# Altium project Pedal_Filters.PrjPcb
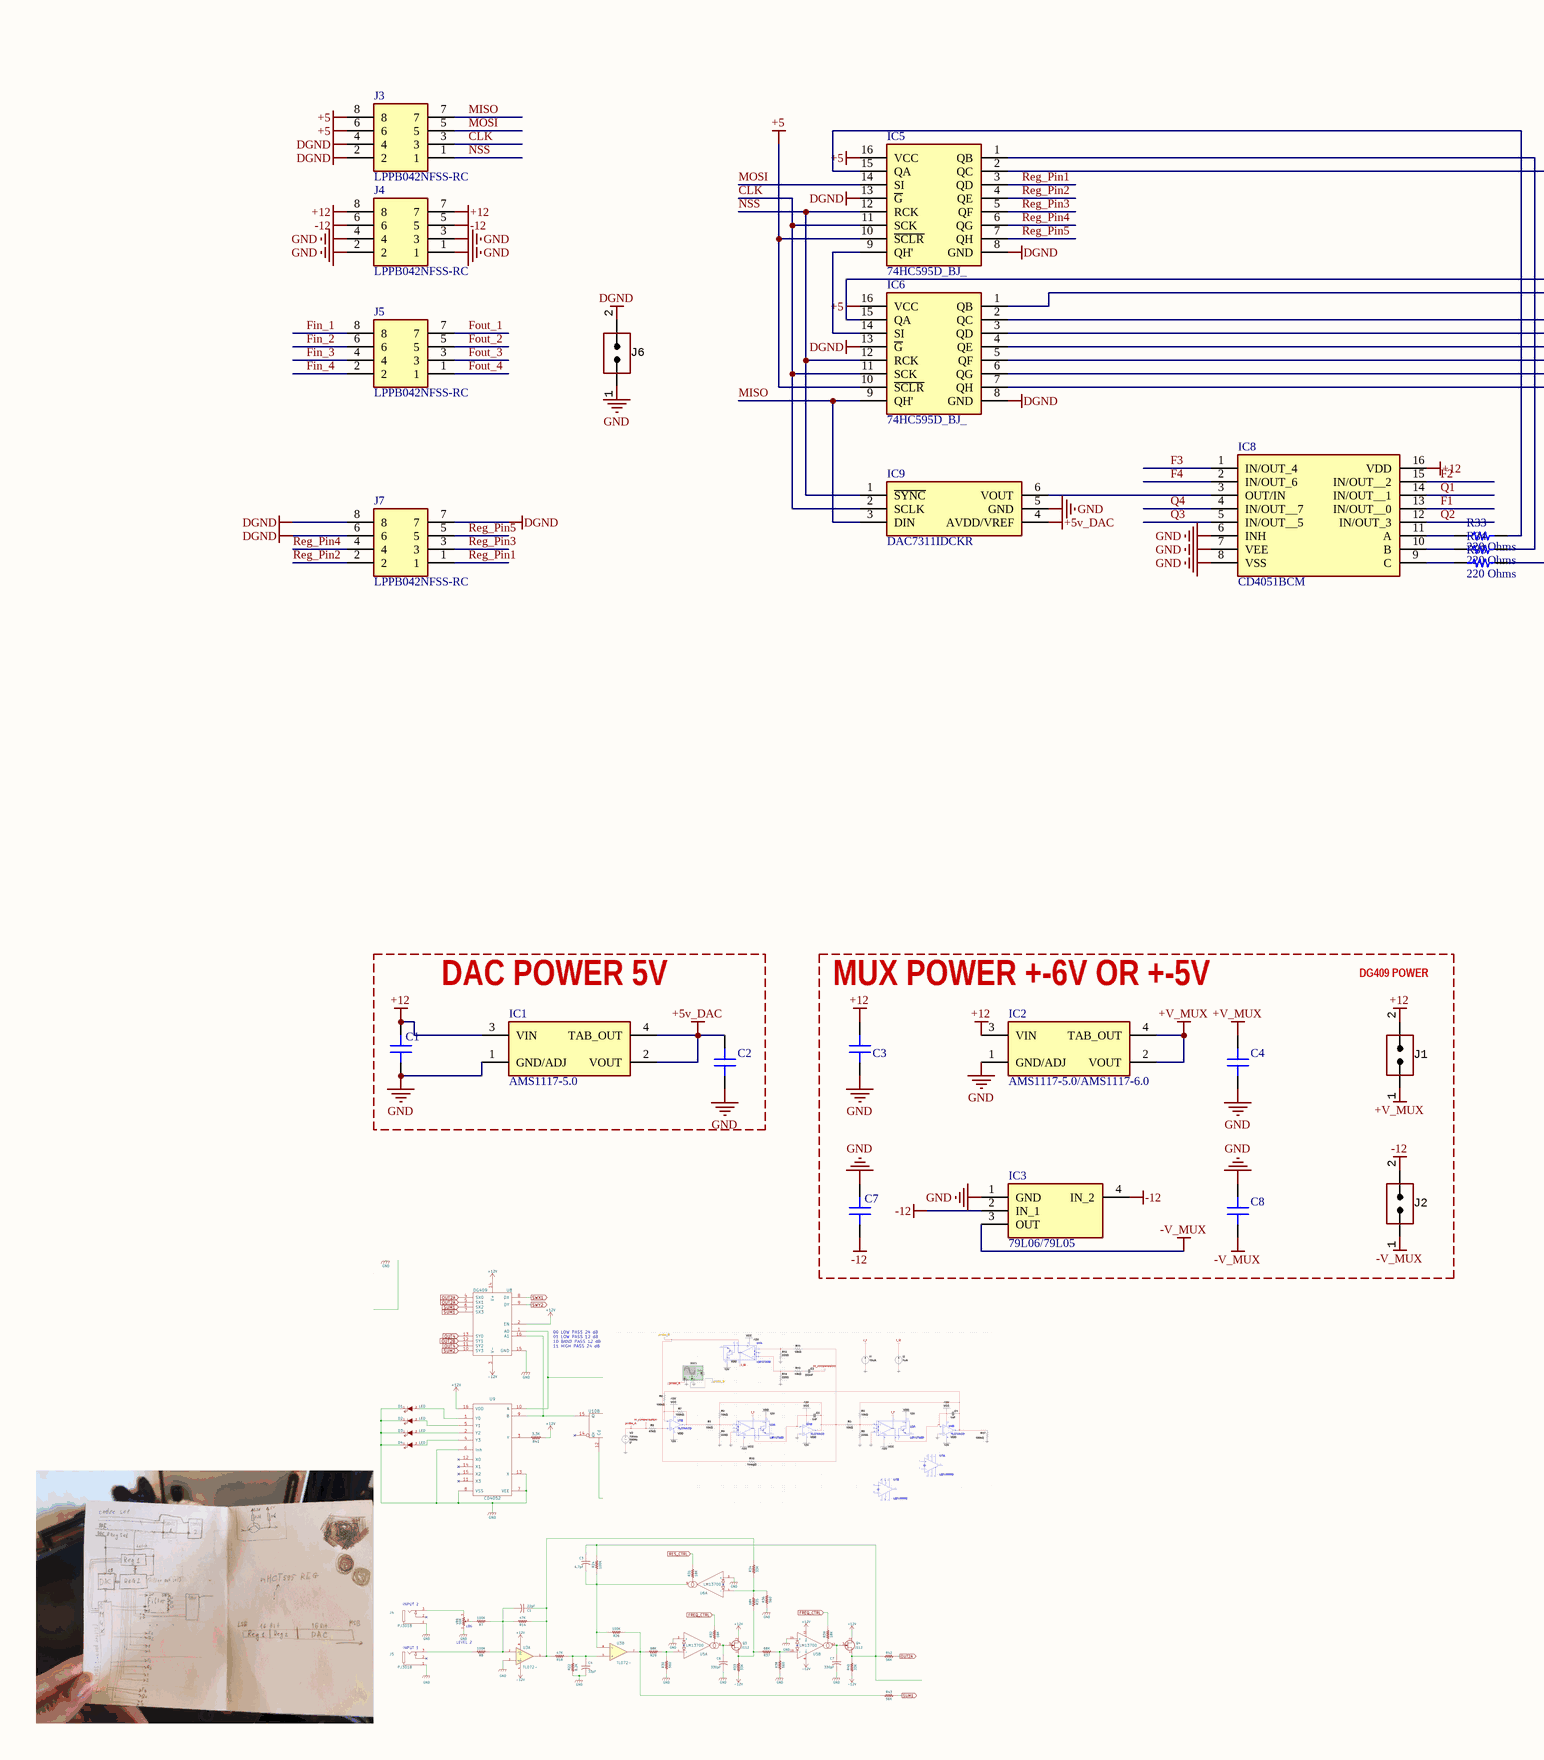
[diagram p0: Pedal_Filters.SchDoc, left]
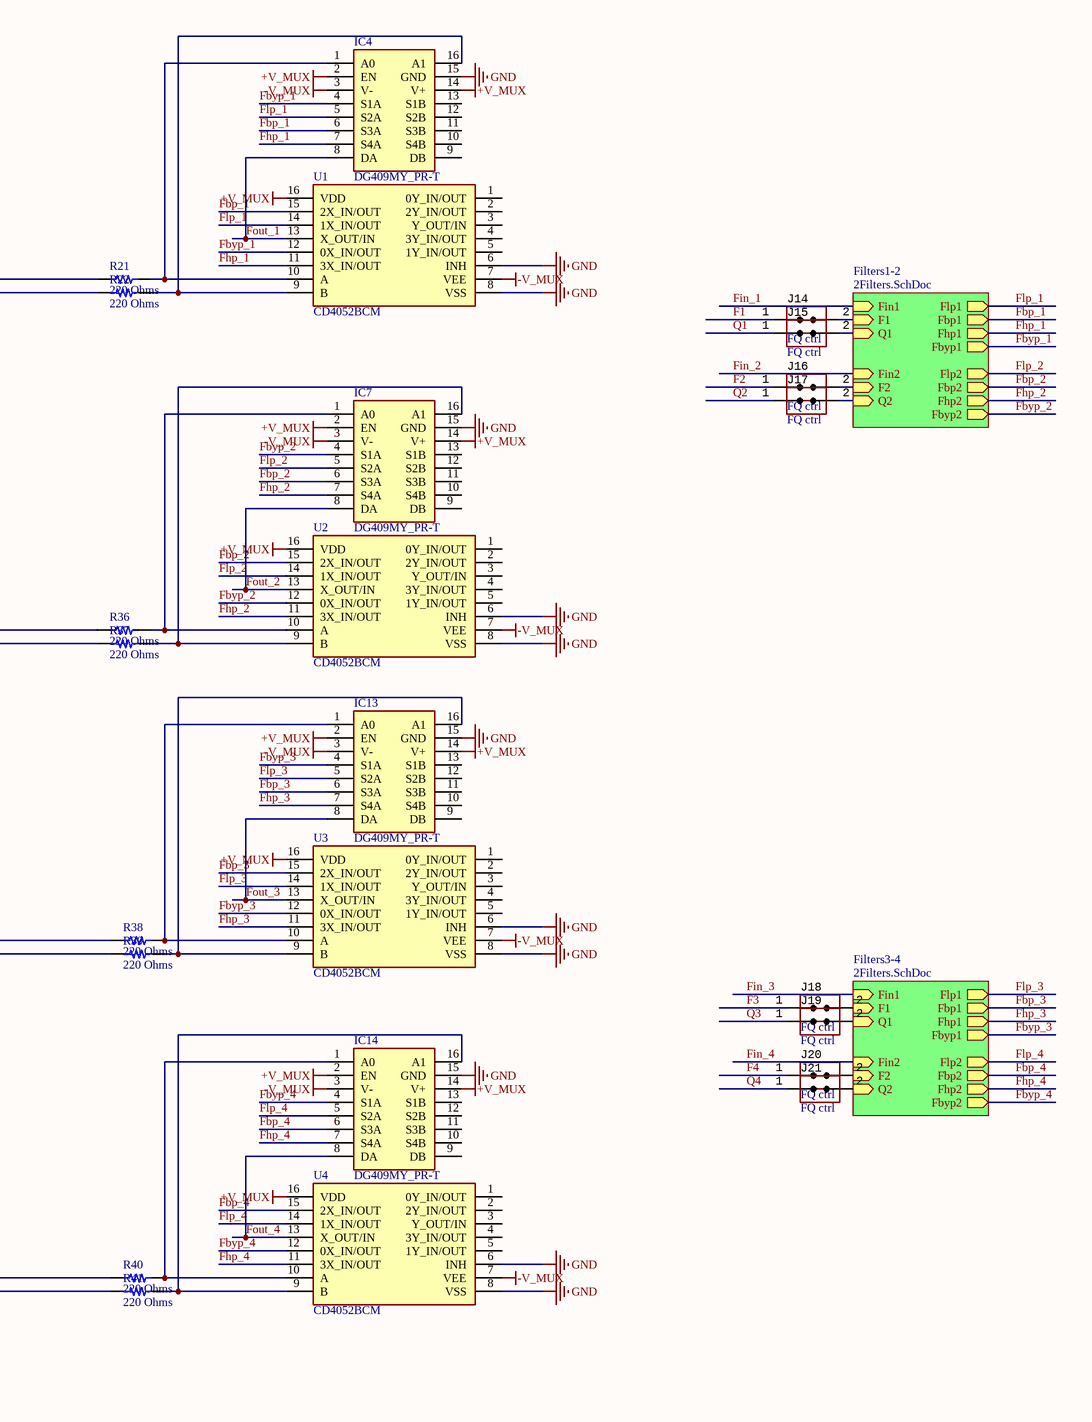
[diagram p1: Pedal_Filters.SchDoc, right]
2 sheets, 245 parts. Net scope: hierarchical (ports join the sheet entries above them; power ports are global).
Board file: Pedal_Filters.PcbDoc
Sheets:
  Pedal_Filters.SchDoc
    Filters1-2 = 2Filters.SchDoc
    Filters3-4 = 2Filters.SchDoc

## Sheet Pedal_Filters.SchDoc
size A2; SheetNumber: 1; SheetTotal: 2

### Parts
C1  (no value)  [CAP 0805_2012]
C2  (no value)  [CAP 0805_2012]
C3  (no value)  [CAP 0805_2012]
C4  (no value)  [CAP 0805_2012]
C7  (no value)  [CAP 0805_2012]
C8  (no value)  [CAP 0805_2012]
IC1  AMS1117-5.0  [SOT-223]
IC2  AMS1117-5.0/AMS1117-6.0  [SOT-223]
IC3  79L06/79L05  [79L06]
IC4  DG409MY_PR-T  [SOIC127P600X175-16N]
IC5  74HC595D_BJ_  [SOIC127P600X175-16N]
IC6  74HC595D_BJ_  [SOIC127P600X175-16N]
IC7  DG409MY_PR-T  [SOIC127P600X175-16N]
IC8  CD4051BCM  [SOIC127P599X175-16N]
IC9  DAC7311IDCKR  [SOT65P210X110-6N]
IC13  DG409MY_PR-T  [SOIC127P600X175-16N]
IC14  DG409MY_PR-T  [SOIC127P600X175-16N]
J1  V_MUX = 12V  [CON: JUMPER x1]  (value not drawn)
J2  V_MUX = 12V  [CON: JUMPER x1]  (value not drawn)
J3  LPPB042NFSS-RC  [LPPB042NFSSRC]
J4  LPPB042NFSS-RC  [LPPB042NFSSRC]
J5  LPPB042NFSS-RC  [LPPB042NFSSRC]
J6  (no value)  [CON: JUMPER x1]
J7  LPPB042NFSS-RC  [LPPB042NFSSRC]
J14  FQ ctrl  [CON: JUMPER x1]
J15  FQ ctrl  [CON: JUMPER x1]
J16  FQ ctrl  [CON: JUMPER x1]
J17  FQ ctrl  [CON: JUMPER x1]
J18  FQ ctrl  [CON: JUMPER x1]
J19  FQ ctrl  [CON: JUMPER x1]
J20  FQ ctrl  [CON: JUMPER x1]
J21  FQ ctrl  [CON: JUMPER x1]
R21  220 Ohms  [RES 0603_1608]
R22  220 Ohms  [RES 0603_1608]
R33  220 Ohms  [RES 0603_1608]
R34  220 Ohms  [RES 0603_1608]
R35  220 Ohms  [RES 0603_1608]
R36  220 Ohms  [RES 0603_1608]
R37  220 Ohms  [RES 0603_1608]
R38  220 Ohms  [RES 0603_1608]
R39  220 Ohms  [RES 0603_1608]
R40  220 Ohms  [RES 0603_1608]
R41  220 Ohms  [RES 0603_1608]
U1  CD4052BCM  [SOIC127P599X175-16N]
U2  CD4052BCM  [SOIC127P599X175-16N]
U3  CD4052BCM  [SOIC127P599X175-16N]
U4  CD4052BCM  [SOIC127P599X175-16N]

### Blocks framed on the sheet
DAC POWER 5V: C1 C2 IC1
MUX POWER +-6V OR +-5V: C3 C4 C7 C8 IC2 IC3 J1 J2

### Sub-sheets
Filters1-2 = 2Filters.SchDoc: Flp1 (out), Fbp1 (out), Fhp1 (out), Fbyp1 (out), Flp2 (out), Fbp2 (out), Fhp2 (out), Fbyp2 (out), Fin2 (in), Fin1 (in), F1 (in), Q1 (in), F2 (in), Q2 (in)
Filters3-4 = 2Filters.SchDoc: Flp1 (out), Fbp1 (out), Fhp1 (out), Fbyp1 (out), Flp2 (out), Fbp2 (out), Fhp2 (out), Fbyp2 (out), F1 (in), Q1 (in), Fin1 (in), Fin2 (in), F2 (in), Q2 (in)

### Nets
+5: IC5.10(~{SCLR}) IC5.16(VCC) IC6.10(~{SCLR}) IC6.16(VCC) J3.6 J3.8
+5v_DAC: C2.2 IC1.2(VOUT) IC1.4(TAB_OUT) IC9.4(AVDD/VREF)
+12: C1.2 C3.1 IC1.3(VIN) IC2.3(VIN) IC8.16(VDD) J1.2(IN) J4.7 J4.8
+V_MUX: C4.2 IC2.2(VOUT) IC2.4(TAB_OUT) IC4.2(EN) IC4.14(V+) IC7.2(EN) IC7.14(V+) IC13.2(EN) IC13.14(V+) IC14.2(EN) IC14.14(V+) J1.1(IN) U1.16(VDD) U2.16(VDD) U3.16(VDD) U4.16(VDD)
-12: C7.1 IC3.2(IN_1) IC3.4(IN_2) J2.2(IN) J4.5 J4.6
-V_MUX: C8.1 IC3.3(OUT) IC4.3(V-) IC7.3(V-) IC13.3(V-) IC14.3(V-) J2.1(IN) U1.7(VEE) U2.7(VEE) U3.7(VEE) U4.7(VEE)
DGND: IC5.8(GND) IC5.13(~{G}) IC6.8(GND) IC6.13(~{G}) J3.2 J3.4 J6.2(IN) J7.6 J7.7 J7.8
GND: C1.1 C2.1 C3.2 C4.1 C7.2 C8.2 IC1.1(GND/ADJ) IC2.1(GND/ADJ) IC3.1(GND) IC4.15(GND) IC7.15(GND) IC8.6(INH) IC8.7(VEE) IC8.8(VSS) IC9.5(GND) IC13.15(GND) IC14.15(GND) J4.1 J4.2 J4.3 J4.4 J6.1(IN) U1.6(INH) U1.8(VSS) U2.6(INH) U2.8(VSS) U3.6(INH) U3.8(VSS) U4.6(INH) U4.8(VSS)
CLK: IC5.11(SCK) IC6.11(SCK) IC9.2(SCLK) J3.3
F1: IC8.13(IN/OUT__0) J14.1(IN)
F2: IC8.15(IN/OUT__2) J16.1(IN)
F3: IC8.1(IN/OUT_4) J18.1(IN)
F4: IC8.2(IN/OUT_6) J20.1(IN)
F_POT_W1: J14.2(IN) ; sheet Filters1-2/F1
F_POT_W1: J18.2(IN) ; sheet Filters3-4/F1  [a separate net that carries the same name]
F_POT_W2: J16.2(IN) ; sheet Filters1-2/F2
F_POT_W2: J20.2(IN) ; sheet Filters3-4/F2  [a separate net that carries the same name]
Fbp_1: IC4.6(S3A) U1.15(2X_IN/OUT) ; sheet Filters1-2/Fbp1  [project net Fbp1]
Fbp_2: IC7.6(S3A) U2.15(2X_IN/OUT) ; sheet Filters1-2/Fbp2  [project net Fbp2]
Fbp_3: IC13.6(S3A) U3.15(2X_IN/OUT) ; sheet Filters3-4/Fbp1  [project net Fbp1]
Fbp_4: IC14.6(S3A) U4.15(2X_IN/OUT) ; sheet Filters3-4/Fbp2  [project net Fbp2]
Fbyp_1: IC4.4(S1A) J5.8 U1.12(0X_IN/OUT) ; sheet Filters1-2/Fbyp1, sheet Filters1-2/Fin1  [also labelled Fin_1]
Fbyp_2: IC7.4(S1A) J5.6 U2.12(0X_IN/OUT) ; sheet Filters1-2/Fbyp2, sheet Filters1-2/Fin2  [also labelled Fin_2]
Fbyp_3: IC13.4(S1A) J5.4 U3.12(0X_IN/OUT) ; sheet Filters3-4/Fbyp1, sheet Filters3-4/Fin1  [also labelled Fin_3]
Fbyp_4: IC14.4(S1A) J5.2 U4.12(0X_IN/OUT) ; sheet Filters3-4/Fbyp2, sheet Filters3-4/Fin2  [also labelled Fin_4]
Fhp_1: IC4.7(S4A) U1.11(3X_IN/OUT) ; sheet Filters1-2/Fhp1  [project net Fhp1]
Fhp_2: IC7.7(S4A) U2.11(3X_IN/OUT) ; sheet Filters1-2/Fhp2  [project net Fhp2]
Fhp_3: IC13.7(S4A) U3.11(3X_IN/OUT) ; sheet Filters3-4/Fhp1  [project net Fhp1]
Fhp_4: IC14.7(S4A) U4.11(3X_IN/OUT) ; sheet Filters3-4/Fhp2  [project net Fhp2]
Flp_1: IC4.5(S2A) U1.14(1X_IN/OUT) ; sheet Filters1-2/Flp1  [project net Flp1]
Flp_2: IC7.5(S2A) U2.14(1X_IN/OUT) ; sheet Filters1-2/Flp2  [project net Flp2]
Flp_3: IC13.5(S2A) U3.14(1X_IN/OUT) ; sheet Filters3-4/Flp1  [project net Flp1]
Flp_4: IC14.5(S2A) U4.14(1X_IN/OUT) ; sheet Filters3-4/Flp2  [project net Flp2]
Fout_1: IC4.8(DA) J5.7 U1.13(X_OUT/IN)
Fout_2: IC7.8(DA) J5.5 U2.13(X_OUT/IN)
Fout_3: IC13.8(DA) J5.3 U3.13(X_OUT/IN)
Fout_4: IC14.8(DA) J5.1 U4.13(X_OUT/IN)
MISO: IC6.9(QH') IC9.3(DIN) J3.7
MOSI: IC5.14(SI) J3.5
NSS: IC5.12(RCK) IC6.12(RCK) IC9.1(~{SYNC}) J3.1
Q1: IC8.14(IN/OUT__1) J15.1(IN)
Q2: IC8.12(IN/OUT_3) J17.1(IN)
Q3: IC8.5(IN/OUT__5) J19.1(IN)
Q4: IC8.4(IN/OUT__7) J21.1(IN)
Q_POT_W1: J15.2(IN) ; sheet Filters1-2/Q1
Q_POT_W1: J19.2(IN) ; sheet Filters3-4/Q1  [a separate net that carries the same name]
Q_POT_W2: J17.2(IN) ; sheet Filters1-2/Q2
Q_POT_W2: J21.2(IN) ; sheet Filters3-4/Q2  [a separate net that carries the same name]
Reg_Pin1: IC5.3(QD) J7.1
Reg_Pin2: IC5.4(QE) J7.2
Reg_Pin3: IC5.5(QF) J7.3
Reg_Pin4: IC5.6(QG) J7.4
Reg_Pin5: IC5.7(QH) J7.5
NetIC4_1: IC4.1(A0) R21.1 U1.10(A)
NetIC4_16: IC4.16(A1) R22.1 U1.9(B)
NetIC5_1: IC5.1(QB) R34.1
NetIC5_2: IC5.2(QC) R35.1
NetIC5_9: IC5.9(QH') IC6.14(SI)
NetIC5_15: IC5.15(QA) R33.1
NetIC6_1: IC6.1(QB) R22.2
NetIC6_2: IC6.2(QC) R36.2
NetIC6_3: IC6.3(QD) R37.2
NetIC6_4: IC6.4(QE) R38.2
NetIC6_5: IC6.5(QF) R39.2
NetIC6_6: IC6.6(QG) R40.2
NetIC6_7: IC6.7(QH) R41.2
NetIC6_15: IC6.15(QA) R21.2
NetIC7_1: IC7.1(A0) R36.1 U2.10(A)
NetIC7_16: IC7.16(A1) R37.1 U2.9(B)
NetIC8_3: IC8.3(OUT/IN) IC9.6(VOUT)
NetIC8_9: IC8.9(C) R35.2
NetIC8_10: IC8.10(B) R34.2
NetIC8_11: IC8.11(A) R33.2
NetIC13_1: IC13.1(A0) R38.1 U3.10(A)
NetIC13_16: IC13.16(A1) R39.1 U3.9(B)
NetIC14_1: IC14.1(A0) R40.1 U4.10(A)
NetIC14_16: IC14.16(A1) R41.1 U4.9(B)

Not connected (* = marked no-connect by the designer): IC4 9(DB) 10(S4B) 11(S3B) 12(S2B) 13(S1B); IC7 9(DB) 10(S4B) 11(S3B) 12(S2B) 13(S1B); IC13 9(DB) 10(S4B) 11(S3B) 12(S2B) 13(S1B); IC14 9(DB) 10(S4B) 11(S3B) 12(S2B) 13(S1B); U1 1(0Y_IN/OUT) 2(2Y_IN/OUT) 3(Y_OUT/IN) 4(3Y_IN/OUT) 5(1Y_IN/OUT); U2 1(0Y_IN/OUT) 2(2Y_IN/OUT) 3(Y_OUT/IN) 4(3Y_IN/OUT) 5(1Y_IN/OUT); U3 1(0Y_IN/OUT) 2(2Y_IN/OUT) 3(Y_OUT/IN) 4(3Y_IN/OUT) 5(1Y_IN/OUT); U4 1(0Y_IN/OUT) 2(2Y_IN/OUT) 3(Y_OUT/IN) 4(3Y_IN/OUT) 5(1Y_IN/OUT)

### Notes on the sheet
- DG409 POWER

### Library data of the parts
C1 C3 C7 = EMK212B7105KGHTR: CAP CER 1UF 16V X7R 0805; Capacitance: 1 µF; Part Number: EMK212B7105KGHTR
C2 C4 C8 = LMK212ABJ106KD-T: CAP CER 10UF 10V X5R 0805; Capacitance: 10 µF; Part Number: LMK212ABJ106KD-T
IC1 IC2 = AMS1117-5.0: Integrated Circuit; Manufacturer_Name: Advanced Monolithic Systems; Datasheet Link: http://www.advanced-monolithic.com/pdf/ds1117.pdf; Height: 1.8mm; Manufacturer_Part_Number: AMS1117-5.0
IC3 = 79L06: Integrated Circuit; Manufacturer_Name: MDD; Datasheet Link: https://datasheet.lcsc.com/szlcsc/1909231507_MDD-Microdiode-Electronics-79L06_C414030.pdf; Height: 1.6mm; Manufacturer_Part_Number: 79L06
IC4 IC7 IC13 IC14 = DG409MY_PR-T: Integrated Circuit; Manufacturer_Name: Analog Devices; Manufacturer_Part_Number: DG409MY/PR-T
IC5 IC6 = 74HC595D_BJ_: Integrated Circuit; Manufacturer_Name: Toshiba; Manufacturer_Part_Number: 74HC595D(BJ); Datasheet Link: https://componentsearchengine.com/Datasheets/1/74HC595D(BJ).pdf; Height: 1.75mm; Mouser Part Number: 757-74HC595DBJ; Mouser Price/Stock: https://www.mouser.co.uk/ProductDetail/Toshiba/74HC595DBJ?qs=T%2FywbITssnTkqd02WdSNRg%3D%3D; Arrow Part Number: 74HC595D(BJ); Arrow Price/Stock: https://www.arrow.com/en/products/74hc595d-bj/toshiba?region=nac
IC8 = CD4051BCM: Integrated Circuit; Manufacturer_Name: onsemi; Datasheet Link: https://media.digikey.com/pdf/Data%20Sheets/Fairchild%20PDFs/CD4051BC.pdf; Height: 1.753mm; Manufacturer_Part_Number: CD4051BCM; Mouser Part Number: 512-CD4051BCM; Mouser Price/Stock: https://www.mouser.com/Search/Refine.aspx?Keyword=512-CD4051BCM
IC9 = DAC7311IDCKR: Integrated Circuit; Manufacturer_Name: Texas Instruments; Datasheet Link: https://datasheet.lcsc.com/szlcsc/Texas-Instruments-TI-DAC7311IDCKR_C128601.pdf; Height: 1.1mm; Manufacturer_Part_Number: DAC7311IDCKR; Mouser Part Number: 595-DAC7311IDCKR; Mouser Price/Stock: https://www.mouser.co.uk/ProductDetail/Texas-Instruments/DAC7311IDCKR?qs=z3YOdW4mbAwW%2FH6OJTW4CQ%3D%3D; Arrow Part Number: DAC7311IDCKR; Arrow Price/Stock: https://www.arrow.com/en/products/dac7311idckr/texas-instruments?region=nac
J1 J2 J6 J14-J21 = Jumper_single: CommentText: "Перемычка"
J3-J5 J7 = LPPB042NFSS-RC: Connector; Manufacturer_Name: Sullins; Datasheet Link: https://www.sullinscorp.com/drawings/88_LPPB___2NFSS-RC,_11017.pdf; Height: 4.65mm; Manufacturer_Part_Number: LPPB042NFSS-RC; System: Connector
R21 R22 R33-R41 = CRCW0603220RFKEA: RES SMD 220 OHM 1% 1/10W 0603; Part Number: CRCW0603220RFKEA; Value: 220 Ohms
U1-U4 = CD4052BCM: Undefined or Miscellaneous; Manufacturer_Name: onsemi; Datasheet Link: https://datasheet.datasheetarchive.com/originals/distributors/Datasheets_SAMA/f70c20124315e8f3af2d52f76e34e12a.pdf; Height: 1.753mm; Manufacturer_Part_Number: CD4052BCM; Mouser Part Number: 512-CD4052BCM; Mouser Price/Stock: https://www.mouser.co.uk/ProductDetail/onsemi-Fairchild/CD4052BCM?qs=ZhimqmYZ5InGEAD%2FeTU3GA%3D%3D

## Sheet 2Filters.SchDoc
size A1; SheetNumber: 2; SheetTotal: 2
Used 2 times, as channels Filters1-2, Filters3-4. Parts and nets are listed once, with the designators drawn on the sheet.
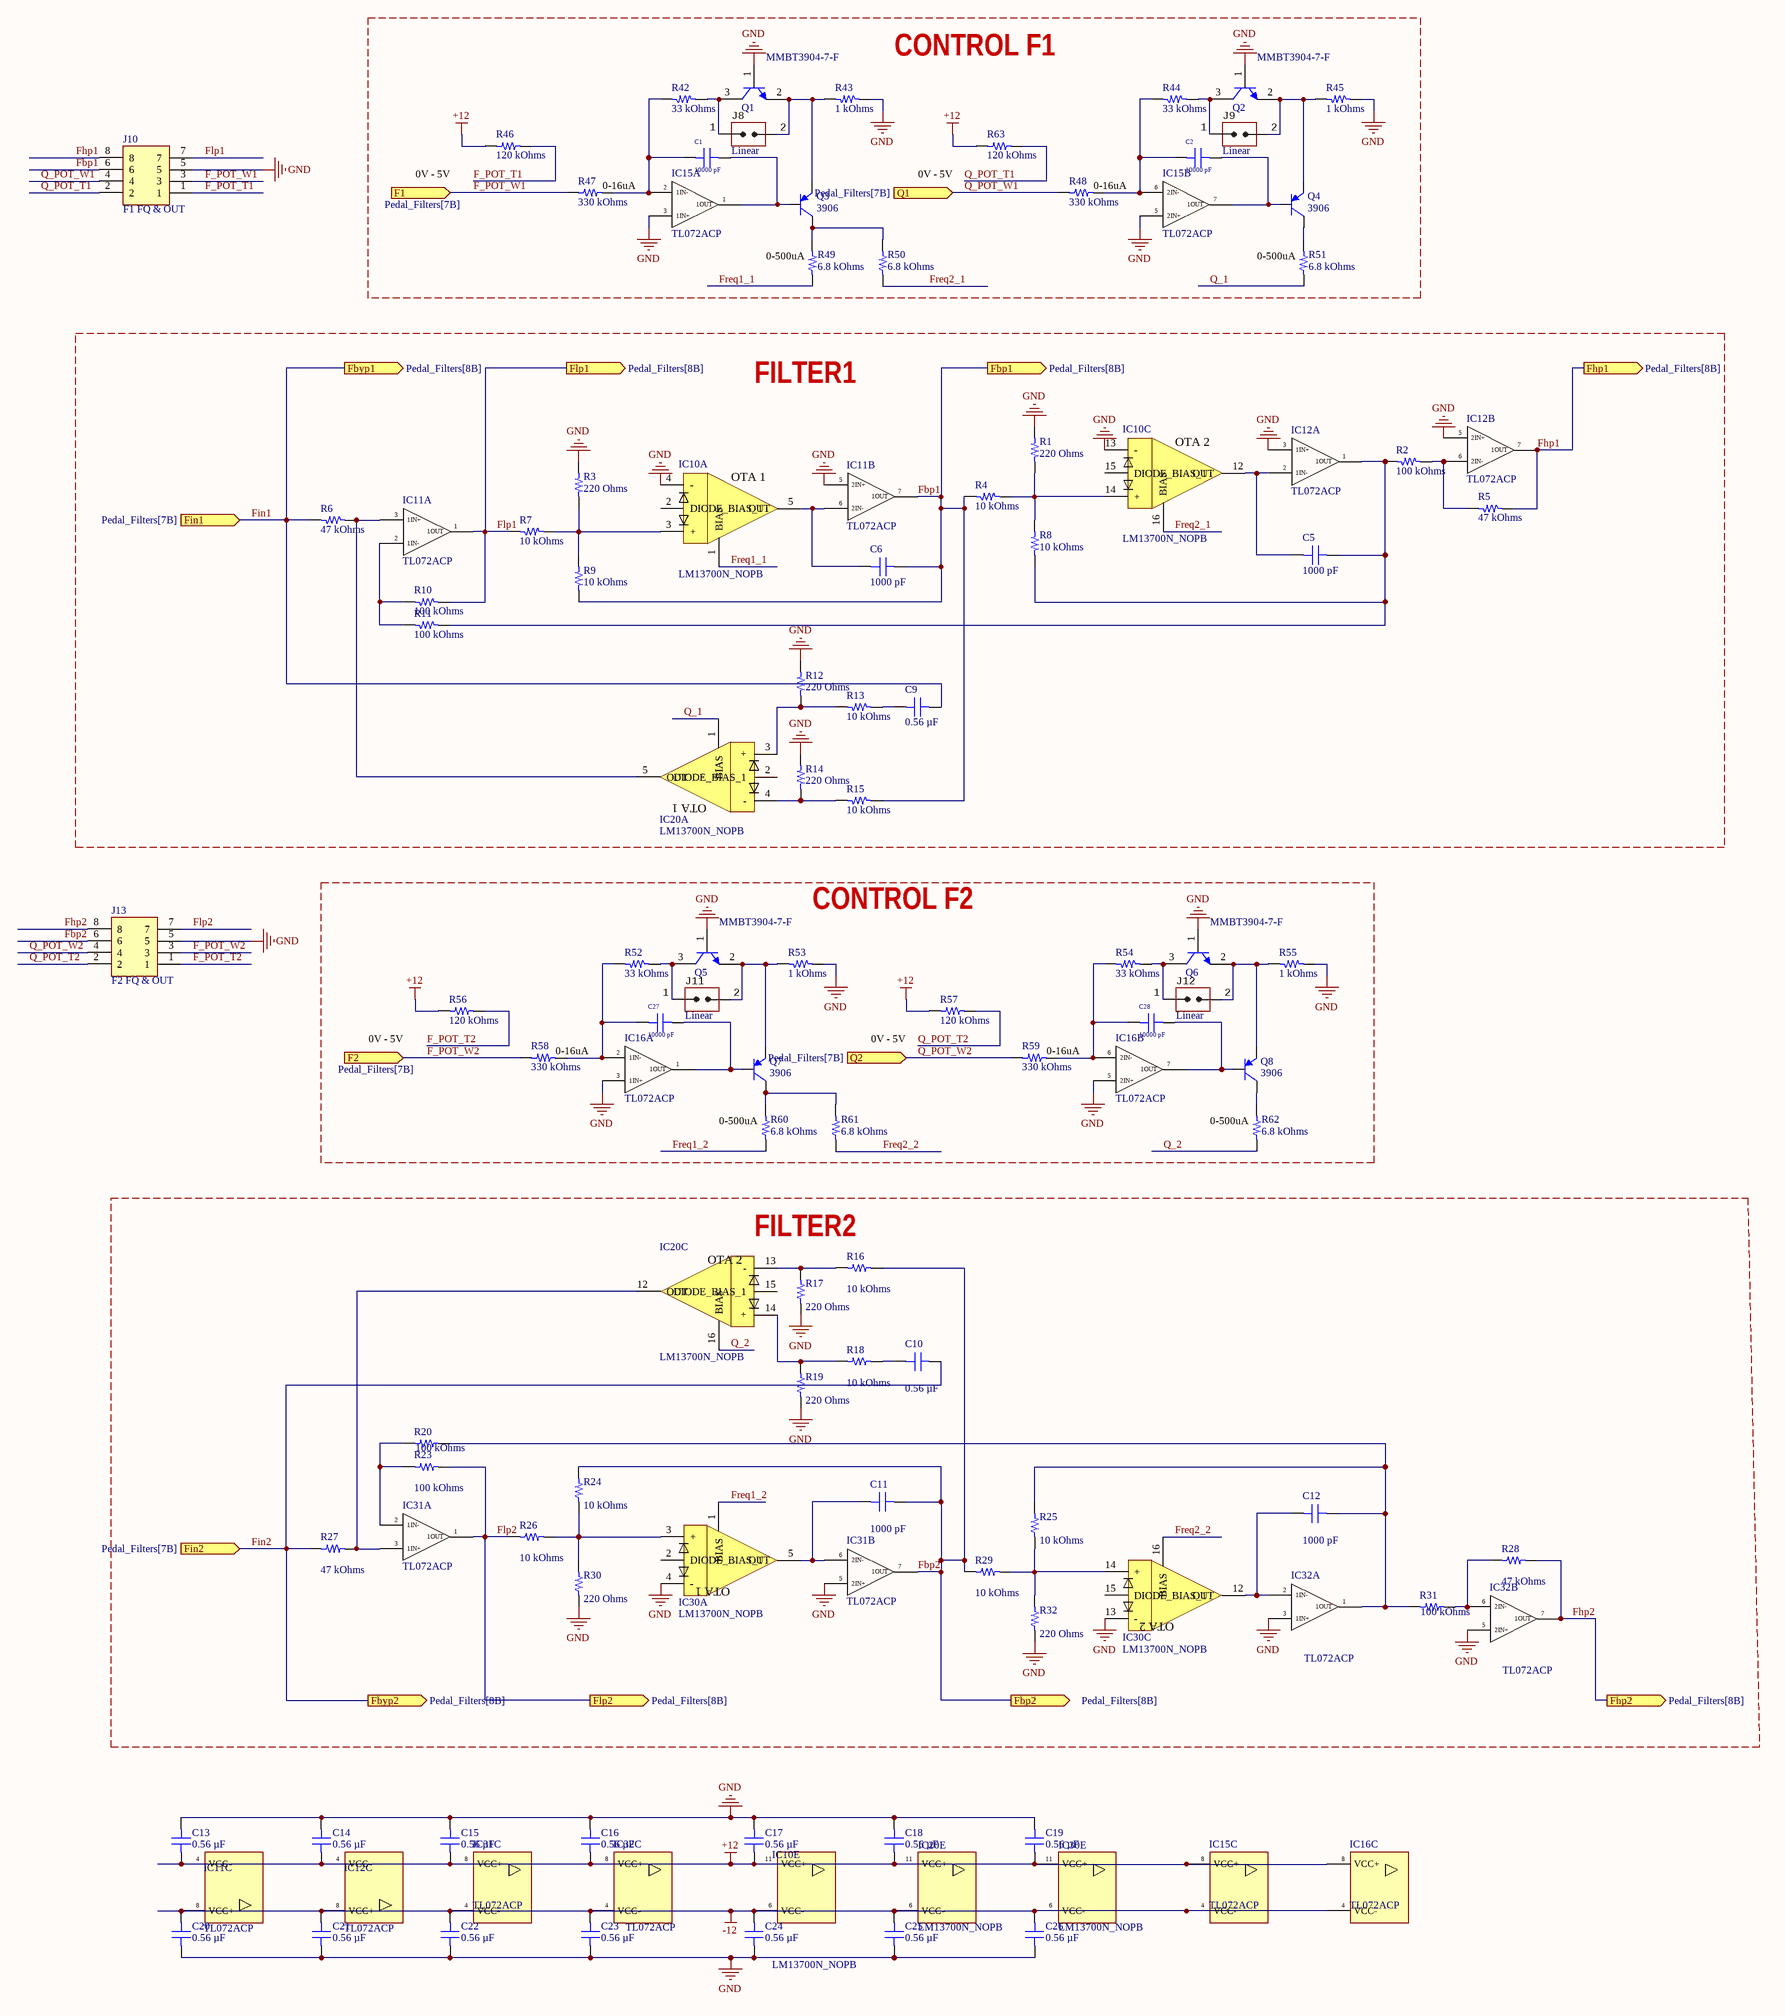
[diagram p2: 2Filters.SchDoc]

### Parts
C1  10000 pF  [MURATA GRM188 0603_1608]
C2  10000 pF  [MURATA GRM188 0603_1608]
C5  Capacitance: 1000 pF  [CAP 0805_2012]
C6  Capacitance: 1000 pF  [CAP 0805_2012]
C9  Capacitance: 0.56 µF  [CAP 0805_2012]
C10  Capacitance: 0.56 µF  [CAP 0805_2012]
C11  Capacitance: 1000 pF  [CAP 0805_2012]
C12  Capacitance: 1000 pF  [CAP 0805_2012]
C13  Capacitance: 0.56 µF  [CAP 0805_2012]
C14  Capacitance: 0.56 µF  [CAP 0805_2012]
C15  Capacitance: 0.56 µF  [CAP 0805_2012]
C16  Capacitance: 0.56 µF  [CAP 0805_2012]
C17  Capacitance: 0.56 µF  [CAP 0805_2012]
C18  Capacitance: 0.56 µF  [CAP 0805_2012]
C19  Capacitance: 0.56 µF  [CAP 0805_2012]
C20  Capacitance: 0.56 µF  [CAP 0805_2012]
C21  Capacitance: 0.56 µF  [CAP 0805_2012]
C22  Capacitance: 0.56 µF  [CAP 0805_2012]
C23  Capacitance: 0.56 µF  [CAP 0805_2012]
C24  Capacitance: 0.56 µF  [CAP 0805_2012]
C25  Capacitance: 0.56 µF  [CAP 0805_2012]
C26  Capacitance: 0.56 µF  [CAP 0805_2012]
C27  10000 pF  [MURATA GRM188 0603_1608]
C28  10000 pF  [MURATA GRM188 0603_1608]
IC10  LM13700N_NOPB  [SOIC-16]  (parts A,C,E of 5)
IC11  TL072ACP  [SOIC-8]  (parts A,B,C of 3)
IC12  TL072ACP  [SOIC-8]  (parts A,B,C of 3)
IC15  TL072ACP  [SOIC-8]  (parts A,B,C of 3)
IC16  TL072ACP  [SOIC-8]  (parts A,B,C of 3)
IC20  LM13700N_NOPB  [SOIC-16]  (parts A,C,E of 5)
IC30  LM13700N_NOPB  [SOIC-16]  (parts A,C,E of 5)
IC31  TL072ACP  [SOIC-8]  (parts A,B,C of 3)
IC32  TL072ACP  [SOIC-8]  (parts A,B,C of 3)
J8  Linear  [CON: JUMPER x1]
J9  Linear  [CON: JUMPER x1]
J10  F1 FQ & OUT  [LPPB042NFSSRC]
J11  Linear  [CON: JUMPER x1]
J12  Linear  [CON: JUMPER x1]
J13  F2 FQ & OUT  [LPPB042NFSSRC]
Q1  MMBT3904-7-F  [DIODES SOT-23-3]
Q2  MMBT3904-7-F  [DIODES SOT-23-3]
Q3  3906  [SOT-23]
Q4  3906  [SOT-23]
Q5  MMBT3904-7-F  [DIODES SOT-23-3]
Q6  MMBT3904-7-F  [DIODES SOT-23-3]
Q7  3906  [SOT-23]
Q8  3906  [SOT-23]
R1  220 Ohms  [RES 0603_1608]
R2  100 kOhms  [RES 0603_1608]
R3  220 Ohms  [RES 0603_1608]
R4  10 kOhms  [RES 0603_1608]
R5  47 kOhms  [RES 0603_1608]
R6  47 kOhms  [RES 0603_1608]
R7  10 kOhms  [RES 0603_1608]
R8  10 kOhms  [RES 0603_1608]
R9  10 kOhms  [RES 0603_1608]
R10  100 kOhms  [RES 0603_1608]
R11  100 kOhms  [RES 0603_1608]
R12  220 Ohms  [RES 0603_1608]
R13  10 kOhms  [RES 0603_1608]
R14  220 Ohms  [RES 0603_1608]
R15  10 kOhms  [RES 0603_1608]
R16  10 kOhms  [RES 0603_1608]
R17  220 Ohms  [RES 0603_1608]
R18  10 kOhms  [RES 0603_1608]
R19  220 Ohms  [RES 0603_1608]
R20  100 kOhms  [RES 0603_1608]
R23  100 kOhms  [RES 0603_1608]
R24  10 kOhms  [RES 0603_1608]
R25  10 kOhms  [RES 0603_1608]
R26  10 kOhms  [RES 0603_1608]
R27  47 kOhms  [RES 0603_1608]
R28  47 kOhms  [RES 0603_1608]
R29  10 kOhms  [RES 0603_1608]
R30  220 Ohms  [RES 0603_1608]
R31  100 kOhms  [RES 0603_1608]
R32  220 Ohms  [RES 0603_1608]
R42  33 kOhms  [YAGEO RES 0603_1608]
R43  1 kOhms  [YAGEO RES 0603_1608]
R44  33 kOhms  [YAGEO RES 0603_1608]
R45  1 kOhms  [YAGEO RES 0603_1608]
R46  120 kOhms  [YAGEO RES 0603_1608]
R47  330 kOhms  [YAGEO RES 0603_1608]
R48  330 kOhms  [YAGEO RES 0603_1608]
R49  6.8 kOhms  [YAGEO RES 0603_1608]
R50  6.8 kOhms  [YAGEO RES 0603_1608]
R51  6.8 kOhms  [YAGEO RES 0603_1608]
R52  33 kOhms  [YAGEO RES 0603_1608]
R53  1 kOhms  [YAGEO RES 0603_1608]
R54  33 kOhms  [YAGEO RES 0603_1608]
R55  1 kOhms  [YAGEO RES 0603_1608]
R56  120 kOhms  [YAGEO RES 0603_1608]
R57  120 kOhms  [YAGEO RES 0603_1608]
R58  330 kOhms  [YAGEO RES 0603_1608]
R59  330 kOhms  [YAGEO RES 0603_1608]
R60  6.8 kOhms  [YAGEO RES 0603_1608]
R61  6.8 kOhms  [YAGEO RES 0603_1608]
R62  6.8 kOhms  [YAGEO RES 0603_1608]
R63  120 kOhms  [YAGEO RES 0603_1608]

### Blocks framed on the sheet
CONTROL F1: C1 C2 IC15 J8 J9 Q1-Q4 R42-R51 R63
FILTER1: C5 C6 C9 IC10-IC12 IC20 R1-R15
CONTROL F2: C27 C28 IC16 J11 J12 Q5-Q8 R52-R62
FILTER2: C10-C12 IC20 IC30-IC32 R16-R20 R23-R32

### Ports
F1 (in, see Pedal_Filters[7B]), F2 (in, see Pedal_Filters[7B]), Fbp1 (out, see Pedal_Filters[8B]), Fbp2 (out, see Pedal_Filters[8B]), Fbyp1 (out, see Pedal_Filters[8B]), Fbyp2 (out, see Pedal_Filters[8B]), Fhp1 (out, see Pedal_Filters[8B]), Fhp2 (out, see Pedal_Filters[8B]), Fin1 (in, see Pedal_Filters[7B]), Fin2 (in, see Pedal_Filters[7B]), Flp1 (out, see Pedal_Filters[8B]), Flp2 (out, see Pedal_Filters[8B]), Q1 (in, see Pedal_Filters[7B]), Q2 (in, see Pedal_Filters[7B])

### Nets
+12: C13.1 C14.1 C15.1 C16.1 C17.1 C18.1 C19.1 IC10.11(VCC+) IC11.4(VCC-) IC12.4(VCC-) IC15.8(VCC+) IC16.8(VCC+) IC20.11(VCC+) IC30.11(VCC+) IC31.8(VCC+) IC32.8(VCC+) R46.1 R56.1 R57.1 R63.1
-12: C20.2 C21.2 C22.2 C23.2 C24.2 C25.2 C26.2 IC10.6(VCC-) IC11.8(VCC+) IC12.8(VCC+) IC15.4(VCC-) IC16.4(VCC-) IC20.6(VCC-) IC30.6(VCC-) IC31.4(VCC-) IC32.4(VCC-)
GND: C13.2 C14.2 C15.2 C16.2 C17.2 C18.2 C19.2 C20.1 C21.1 C22.1 C23.1 C24.1 C25.1 C26.1 IC10.4(-) IC10.13(-) IC11.5(2IN+) IC12.3(1IN+) IC12.5(2IN+) IC15.3(1IN+) IC15.5(2IN+) IC16.3(1IN+) IC16.5(2IN+) IC30.4(-) IC30.13(-) IC31.5(2IN+) IC32.3(1IN+) IC32.5(2IN+) J10.5 J13.5 Q1.1(B) Q2.1(B) Q5.1(B) Q6.1(B) R1.1 R3.1 R12.1 R14.1 R17.1 R19.1 R30.1 R32.1 R43.2 R45.2 R53.2 R55.2
F_POT_T1: J10.1 R46.2
F_POT_T2: J13.1 R56.2
F_POT_W1: J10.3 R47.1 ; port F1
F_POT_W2: J13.3 R58.1 ; port F2
Fbp1: C6.1 IC11.7(1OUT) J10.6 R4.1 R9.2 R15.2 ; port Fbp1
Fbp2: C11.1 IC31.7(1OUT) J13.6 R16.2 R24.2 R29.1 ; port Fbp2
Fhp1: IC12.7(1OUT) J10.8 R5.2 ; port Fhp1
Fhp2: IC32.7(1OUT) J13.8 R28.2 ; port Fhp2
Fin1: C9.2 R6.1 ; port Fbyp1, port Fin1
Fin2: C10.2 R27.1 ; port Fin2, port Fbyp2
Flp1: IC11.1(1OUT) J10.7 R7.1 R10.2 ; port Flp1
Flp2: IC31.1(1OUT) J13.7 R23.2 R26.1 ; port Flp2
Freq1_1: IC10.1(BIAS) R49.1
Freq1_2: IC30.1(BIAS) R60.1
Freq2_1: IC10.16(BIAS) R50.1
Freq2_2: IC30.16(BIAS) R61.1
Q_1: IC20.1(BIAS) R51.1
Q_2: IC20.16(BIAS) R62.1
Q_POT_T1: J10.2 R63.2
Q_POT_T2: J13.2 R57.2
Q_POT_W1: J10.4 R48.1 ; port Q1
Q_POT_W2: J13.4 R59.1 ; port Q2
NetC1_1: C1.1 IC15.1(1OUT) Q3.1(B)
NetC1_2: C1.2 IC15.2(1IN-) R42.1 R47.2
NetC2_1: C2.1 IC15.7(1OUT) Q4.1(B)
NetC2_2: C2.2 IC15.6(2IN-) R44.1 R48.2
NetC5_1: C5.1 IC12.1(1OUT) R2.1 R8.2 R11.2
NetC5_2: C5.2 IC10.12(OUT) IC12.2(1IN-)
NetC6_2: C6.2 IC10.5(OUT) IC11.6(2IN-)
NetC9_1: C9.1 R13.2
NetC10_1: C10.1 R18.2
NetC11_2: C11.2 IC30.5(OUT) IC31.6(2IN-)
NetC12_1: C12.1 IC32.1(1OUT) R20.2 R25.2 R31.1
NetC12_2: C12.2 IC30.12(OUT) IC32.2(1IN-)
NetC27_1: C27.1 IC16.1(1OUT) Q7.1(B)
NetC27_2: C27.2 IC16.2(1IN-) R52.1 R58.2
NetC28_1: C28.1 IC16.7(1OUT) Q8.1(B)
NetC28_2: C28.2 IC16.6(2IN-) R54.1 R59.2
NetIC10_3: IC10.3(+) R3.2 R7.2 R9.1
NetIC10_14: IC10.14(+) R1.2 R4.2 R8.1
NetIC11_2: IC11.2(1IN-) R10.1 R11.1
NetIC11_3: IC11.3(1IN+) IC20.5(OUT) R6.2
NetIC12_6: IC12.6(2IN-) R2.2 R5.1
NetIC20_3: IC20.3(+) R12.2 R13.1
NetIC20_4: IC20.4(-) R14.2 R15.1
NetIC20_12: IC20.12(OUT) IC31.3(1IN+) R27.2
NetIC20_13: IC20.13(-) R16.1 R17.2
NetIC20_14: IC20.14(+) R18.1 R19.2
NetIC30_3: IC30.3(+) R24.1 R26.2 R30.2
NetIC30_14: IC30.14(+) R25.1 R29.2 R32.2
NetIC31_2: IC31.2(1IN-) R20.1 R23.1
NetIC32_6: IC32.6(2IN-) R28.1 R31.2
NetJ8_1: J8.1(IN) Q1.3(C) R42.2
NetJ8_2: J8.2(IN) Q1.2(E) Q3.2(E) R43.1
NetJ9_1: J9.1(IN) Q2.3(C) R44.2
NetJ9_2: J9.2(IN) Q2.2(E) Q4.2(E) R45.1
NetJ11_1: J11.1(IN) Q5.3(C) R52.2
NetJ11_2: J11.2(IN) Q5.2(E) Q7.2(E) R53.1
NetJ12_1: J12.1(IN) Q6.3(C) R54.2
NetJ12_2: J12.2(IN) Q6.2(E) Q8.2(E) R55.1
NetQ3_3: Q3.3(C) R49.2 R50.2
NetQ4_3: Q4.3(C) R51.2
NetQ7_3: Q7.3(C) R60.2 R61.2
NetQ8_3: Q8.3(C) R62.2

Not connected (* = marked no-connect by the designer): IC10 2(DIODE_BIAS_1) 15(DIODE_BIAS_1); IC20 2(DIODE_BIAS_1) 15(DIODE_BIAS_1); IC30 2(DIODE_BIAS_1) 15(DIODE_BIAS_1)

### Channels
Filters1-2: designators end in _Filters1-2; ports F1=F_POT_W1 F2=F_POT_W2 Fbp1=Fbp1 Fbp2=Fbp2 Fbyp1=Fbyp_1 Fbyp2=Fbyp_2 Fhp1=Fhp1 Fhp2=Fhp2 Fin1=Fbyp_1 Fin2=Fbyp_2 Flp1=Flp1 Flp2=Flp2 Q1=Q_POT_W1 Q2=Q_POT_W2
Filters3-4: designators end in _Filters3-4; ports F1=F_POT_W1 F2=F_POT_W2 Fbp1=Fbp1 Fbp2=Fbp2 Fbyp1=Fbyp_3 Fbyp2=Fbyp_4 Fhp1=Fhp1 Fhp2=Fhp2 Fin1=Fbyp_3 Fin2=Fbyp_4 Flp1=Flp1 Flp2=Flp2 Q1=Q_POT_W1 Q2=Q_POT_W2

### Notes on the sheet
- 0V - 5V
- (near R47) 0-16uA
- (near R63) 0V - 5V
- (near R48) 0-16uA
- (near R49) 0-500uA
- (near R51) 0-500uA
- (near R58) 0-16uA
- (near R57) 0V - 5V
- (near R59) 0-16uA
- (near R60) 0-500uA
- (near R62) 0-500uA
- (in symbol LM13700N_NOPB, part A) OTA 1
- (in symbol LM13700N_NOPB, part C) OTA 2

### Library data of the parts
C1 C2 C27 C28 = GRM1885C1H103JA01D: CAP CER 10000PF 50V C0G/NP0 0603; manufacturer: Murata Electronics; Temperature Coefficient: C0G, NP0; Tolerance: ±5%; Part Number: GRM1885C1H103JA01D; Capacitance: 10000 pF; Applications: General Purpose; componentlink1description: Datasheet; componentlink1url: https://www.murata.com/~/media/webrenewal/support/library/catalog/products/capacitor/mlcc/c02e.ashx?la=en-us; componentlink2description: DigiKey Link; componentlink2url: https://www.digikey.com/en/products/detail/murata-electronics/GRM1885C1H103JA01D/4421555; Device Package: 0603 (1608 Metric); lastupdated: 7/20/2024 12:23:21 AM; Lifecycle Status: Active; Minimum Order: 1; Mounting Type: Surface Mount, MLCC; Operating Temperature: -55°C ~ 125°C; Package / Case: 0603 (1608 Metric); packaging: TapeAndReel; partid: 11077; Part Status: Active; price: 0.02; series: GRM; Size / Dimension: 0.063" L x 0.031" W (1.60mm x 0.80mm); Supplier 1: DigiKey; Supplier Part Number 1: 490-9666-1-ND; Thickness (Max): 0.035" (0.90mm); value: 10000 pF; Voltage - Rated: 50V
C5 C6 C11 C12 = C0805X102J5HACAUTO: CAP CER 0805 1NF 50V ULTRA STABL; Part Number: C0805X102J5HACAUTO
C9 C10 C13-C26 = C0805C564K5RAC7800: CAP CER 0.56UF 50V X7R 0805; Part Number: C0805C564K5RAC7800
IC10 IC20 IC30 = LM13700N_NOPB: Integrated Circuit; Manufacturer_Name: Texas Instruments; Manufacturer_Part_Number: LM13700N/NOPB; Datasheet Link: http://www.ti.com/lit/ds/symlink/lm13700.pdf; Height: 4.318mm; Mouser Part Number: 926-LM13700N/NOPB; Mouser Price/Stock: https://www.mouser.co.uk/ProductDetail/Texas-Instruments/LM13700N-NOPB?qs=X1J7HmVL2ZFKw9D7azZDXw%3D%3D; Arrow Part Number: LM13700N/NOPB; Arrow Price/Stock: https://www.arrow.com/en/products/lm13700nnopb/texas-instruments?region=nac
IC11 IC12 IC15 IC16 IC31 IC32 = TL072ACP: Integrated Circuit; Manufacturer_Name: Texas Instruments; Datasheet Link: http://www.ti.com/lit/ds/symlink/tl071a.pdf; Height: 5.08mm; Manufacturer_Part_Number: TL072ACP; Mouser Part Number: 595-TL072ACP; Mouser Price/Stock: https://www.mouser.co.uk/ProductDetail/Texas-Instruments/TL072ACP?qs=0OT4q4QBUTLFvIZ%252B%2FvrwoQ%3D%3D; Arrow Part Number: TL072ACP; Arrow Price/Stock: https://www.arrow.com/en/products/tl072acp/texas-instruments?utm_currency=USD&region=europe
J8 J9 J11 J12 = Jumper_single: CommentText: "Перемычка"
J10 J13 = LPPB042NFSS-RC: Connector; Manufacturer_Name: Sullins; Datasheet Link: https://www.sullinscorp.com/drawings/88_LPPB___2NFSS-RC,_11017.pdf; Height: 4.65mm; Manufacturer_Part_Number: LPPB042NFSS-RC
Q1 Q2 Q5 Q6 = MMBT3904-7-F: TRANS NPN 40V 0.2A SOT23-3; Manufacturer: Diodes Incorporated; Current - Collector Cutoff (Max): 50nA (ICBO); Current - Collector (Ic) (Max): 200 mA; DC Current Gain (hFE) (Min) @ Ic, Vce: 100 @ 10mA, 1V; Frequency - Transition: 300MHz; Power - Max: 300 mW; Vce Saturation (Max) @ Ib, Ic: 300mV @ 5mA, 50mA; Part Number: MMBT3904-7-F; ComponentLink1Description: Datasheet; ComponentLink1URL: https://www.diodes.com/assets/Datasheets/ds30036.pdf; ComponentLink2Description: DigiKey Link; ComponentLink2URL: https://www.digikey.com/en/products/detail/diodes-incorporated/MMBT3904-7-F/814494; LastUpdated: 2/8/2024 9:54:04 PM; Lifecycle Status: Active; Minimum Order: 1; Mounting Type: Surface Mount; Operating Temperature: -55°C ~ 150°C (TJ); Package / Case: TO-236-3, SC-59, SOT-23-3; Packaging: TapeAndReel; PartId: 85; Part Status: Active; Price: 0.01; Series: -; Supplier 1: DigiKey; Supplier Part Number 1: MMBT3904-FDICT-ND; Supplier Device Package: SOT-23-3; Transistor Type: NPN; Voltage - Collector Emitter Breakdown (Max): 40 V
Q3 Q4 Q7 Q8 = MMBT3906
R1 R3 R12 R14 R17 R19 R30 R32 = CRCW0603220RFKEA: RES SMD 220 OHM 1% 1/10W 0603; Part Number: CRCW0603220RFKEA; Value: 220 Ohms
R2 R10 R11 R20 R23 R31 = CPF0603F100KC1: RES SMD 100K OHM 1% 1/16W 0603; Part Number: CPF0603F100KC1; Value: 100 kOhms
R4 R7-R9 R13 R15 R16 R18 R24-R26 R29 = CRCW060310K0FKEA: RES SMD 10K OHM 1% 1/10W 0603; Part Number: CRCW060310K0FKEA; Value: 10 kOhms
R5 R6 R27 R28 = CRCW060347K0FKEAHP: RES SMD 47K OHM 1% 1/3W 0603; Part Number: CRCW060347K0FKEAHP; Value: 47 kOhms
R42 R44 R52 R54 = AC0603FR-0733KL: RES SMD 33K OHM 1% 1/10W 0603; Manufacturer: Yageo; Power (Watts): 0.1W, 1/10W; Temperature Coefficient: ±100ppm/°C; Part Number: AC0603FR-0733KL; Value: 33 kOhms; ComponentLink1Description: Datasheet; ComponentLink1URL: https://www.yageo.com/upload/media/product/productsearch/datasheet/rchip/PYu-AC_51_RoHS_L_7.pdf; ComponentLink2Description: DigiKey Link; ComponentLink2URL: https://www.digikey.com/en/products/detail/yageo/AC0603FR-0733KL/5896041; Composition: Thick Film; Device Package: 0603 (1608 Metric); Features: Automotive AEC-Q200, Moisture Resistant; Height - Seated (Max): 0.022" (0.55mm); LastUpdated: 7/25/2024 9:19:23 AM; Lifecycle Status: Active; Minimum Order: 1; Number of Terminations: 2; Operating Temperature: -55°C ~ 155°C; Package / Case: 0603 (1608 Metric); Packaging: CutTape; PartId: 17385; Part Status: Active; Price: 0.01; Ratings: AEC-Q200; Resistance: 33 kOhms; Series: AC; Size / Dimension: 0.063" L x 0.031" W (1.60mm x 0.80mm); Supplier 1: DigiKey; Supplier Part Number 1: YAG3598CT-ND; Supplier Device Package: 0603; Tolerance: ±1%
R43 R45 R53 R55 = AA0603FR-071KL: RES SMD 1K OHM 1% 1/10W 0603; Manufacturer: Yageo; Power (Watts): 0.1W, 1/10W; Temperature Coefficient: ±150ppm/°C; Part Number: AA0603FR-071KL; Value: 1 kOhms; ComponentLink1Description: Datasheet; ComponentLink1URL: https://www.yageo.com/upload/media/product/productsearch/datasheet/rchip/PYu-AA_51_RoHS_L_3.pdf; ComponentLink2Description: DigiKey Link; ComponentLink2URL: https://www.digikey.com/en/products/detail/yageo/AA0603FR-071KL/5888847; Composition: Thick Film; Device Package: 0603 (1608 Metric); Features: Anti-Sulfur, Automotive AEC-Q200, Moisture Resistant; Height - Seated (Max): 0.022" (0.55mm); LastUpdated: 7/25/2024 9:19:15 AM; Lifecycle Status: Active; Minimum Order: 1; Number of Terminations: 2; Operating Temperature: -55°C ~ 155°C; Package / Case: 0603 (1608 Metric); Packaging: TapeAndReel; PartId: 64335; Part Status: Active; Price: 0.01; Ratings: AEC-Q200; Resistance: 1 kOhms; Series: AA; Size / Dimension: 0.063" L x 0.031" W (1.60mm x 0.80mm); Supplier 1: DigiKey; Supplier Part Number 1: 13-AA0603FR-071KLCT-ND; Supplier Device Package: 0603; Tolerance: ±1%
R46 R56 R57 R63 = AC0603FR-07120KL: RES SMD 120K OHM 1% 1/10W 0603; Manufacturer: Yageo; Power (Watts): 0.1W, 1/10W; Temperature Coefficient: ±100ppm/°C; Part Number: AC0603FR-07120KL; Value: 120 kOhms; ComponentLink1Description: Datasheet; ComponentLink1URL: https://www.yageo.com/upload/media/product/productsearch/datasheet/rchip/PYu-AC_51_RoHS_L_7.pdf; ComponentLink2Description: DigiKey Link; ComponentLink2URL: https://www.digikey.com/en/products/detail/yageo/AC0603FR-07120KL/5895760; Composition: Thick Film; Device Package: 0603 (1608 Metric); Features: Automotive AEC-Q200, Moisture Resistant; Height - Seated (Max): 0.022" (0.55mm); LastUpdated: 7/25/2024 9:19:23 AM; Lifecycle Status: Active; Minimum Order: 1; Number of Terminations: 2; Operating Temperature: -55°C ~ 155°C; Package / Case: 0603 (1608 Metric); Packaging: CutTape; PartId: 17461; Part Status: Active; Price: 0.01; Ratings: AEC-Q200; Resistance: 120 kOhms; Series: AC; Size / Dimension: 0.063" L x 0.031" W (1.60mm x 0.80mm); Supplier 1: DigiKey; Supplier Part Number 1: YAG3562CT-ND; Supplier Device Package: 0603; Tolerance: ±1%
R47 R48 R58 R59 = AC0603FR-07330KL: RES SMD 330K OHM 1% 1/10W 0603; Manufacturer: Yageo; Power (Watts): 0.1W, 1/10W; Temperature Coefficient: ±100ppm/°C; Part Number: AC0603FR-07330KL; Value: 330 kOhms; ComponentLink1Description: Datasheet; ComponentLink1URL: https://www.yageo.com/upload/media/product/productsearch/datasheet/rchip/PYu-AC_51_RoHS_L_7.pdf; ComponentLink2Description: DigiKey Link; ComponentLink2URL: https://www.digikey.com/en/products/detail/yageo/AC0603FR-07330KL/5896036; Composition: Thick Film; Device Package: 0603 (1608 Metric); Features: Automotive AEC-Q200, Moisture Resistant; Height - Seated (Max): 0.022" (0.55mm); LastUpdated: 7/25/2024 9:19:23 AM; Lifecycle Status: Active; Minimum Order: 1; Number of Terminations: 2; Operating Temperature: -55°C ~ 155°C; Package / Case: 0603 (1608 Metric); Packaging: CutTape; PartId: 17469; Part Status: Active; Price: 0.01; Ratings: AEC-Q200; Resistance: 330 kOhms; Series: AC; Size / Dimension: 0.063" L x 0.031" W (1.60mm x 0.80mm); Supplier 1: DigiKey; Supplier Part Number 1: YAG3594CT-ND; Supplier Device Package: 0603; Tolerance: ±1%
R49-R51 R60-R62 = AC0603FR-076K8L: RES SMD 6.8K OHM 1% 1/10W 0603; Manufacturer: Yageo; Power (Watts): 0.1W, 1/10W; Temperature Coefficient: ±100ppm/°C; Part Number: AC0603FR-076K8L; Value: 6.8 kOhms; ComponentLink1Description: Datasheet; ComponentLink1URL: https://www.yageo.com/upload/media/product/productsearch/datasheet/rchip/PYu-AC_51_RoHS_L_7.pdf; ComponentLink2Description: DigiKey Link; ComponentLink2URL: https://www.digikey.com/en/products/detail/yageo/AC0603FR-076K8L/5896266; Composition: Thick Film; Device Package: 0603 (1608 Metric); Features: Automotive AEC-Q200, Moisture Resistant; Height - Seated (Max): 0.022" (0.55mm); LastUpdated: 7/25/2024 9:19:23 AM; Lifecycle Status: Active; Minimum Order: 1; Number of Terminations: 2; Operating Temperature: -55°C ~ 155°C; Package / Case: 0603 (1608 Metric); Packaging: CutTape; PartId: 17383; Part Status: Active; Price: 0.01; Ratings: AEC-Q200; Resistance: 6.8 kOhms; Series: AC; Size / Dimension: 0.063" L x 0.031" W (1.60mm x 0.80mm); Supplier 1: DigiKey; Supplier Part Number 1: YAG3627CT-ND; Supplier Device Package: 0603; Tolerance: ±1%

## Nets that join several sheets
+12: Pedal_Filters (8 pins), Filters1-2 (20 pins), Filters3-4 (20 pins)
-12: Pedal_Filters (6 pins), Filters1-2 (16 pins), Filters3-4 (16 pins)
GND: Pedal_Filters (30 pins), Filters1-2 (46 pins), Filters3-4 (46 pins)
F_POT_W1: Pedal_Filters (J14.2), Filters1-2 (J10_Filters1-2.3 R47_Filters1-2.1)
F_POT_W1: Pedal_Filters (J18.2), Filters3-4 (J10_Filters3-4.3 R47_Filters3-4.1)
F_POT_W2: Pedal_Filters (J16.2), Filters1-2 (J13_Filters1-2.3 R58_Filters1-2.1)
F_POT_W2: Pedal_Filters (J20.2), Filters3-4 (J13_Filters3-4.3 R58_Filters3-4.1)
Fbp1: Pedal_Filters (IC4.6 U1.15), Filters1-2 (6 pins)
Fbp1: Pedal_Filters (IC13.6 U3.15), Filters3-4 (6 pins)
Fbp2: Pedal_Filters (IC7.6 U2.15), Filters1-2 (6 pins)
Fbp2: Pedal_Filters (IC14.6 U4.15), Filters3-4 (6 pins)
Fbyp_1: Pedal_Filters (IC4.4 J5.8 U1.12), Filters1-2 (C9_Filters1-2.2 R6_Filters1-2.1)
Fbyp_2: Pedal_Filters (IC7.4 J5.6 U2.12), Filters1-2 (C10_Filters1-2.2 R27_Filters1-2.1)
Fbyp_3: Pedal_Filters (IC13.4 J5.4 U3.12), Filters3-4 (C9_Filters3-4.2 R6_Filters3-4.1)
Fbyp_4: Pedal_Filters (IC14.4 J5.2 U4.12), Filters3-4 (C10_Filters3-4.2 R27_Filters3-4.1)
Fhp1: Pedal_Filters (IC4.7 U1.11), Filters1-2 (IC12_Filters1-2.7 J10_Filters1-2.8 R5_Filters1-2.2)
Fhp1: Pedal_Filters (IC13.7 U3.11), Filters3-4 (IC12_Filters3-4.7 J10_Filters3-4.8 R5_Filters3-4.2)
Fhp2: Pedal_Filters (IC7.7 U2.11), Filters1-2 (IC32_Filters1-2.7 J13_Filters1-2.8 R28_Filters1-2.2)
Fhp2: Pedal_Filters (IC14.7 U4.11), Filters3-4 (IC32_Filters3-4.7 J13_Filters3-4.8 R28_Filters3-4.2)
Flp1: Pedal_Filters (IC4.5 U1.14), Filters1-2 (IC11_Filters1-2.1 J10_Filters1-2.7 R7_Filters1-2.1 R10_Filters1-2.2)
Flp1: Pedal_Filters (IC13.5 U3.14), Filters3-4 (IC11_Filters3-4.1 J10_Filters3-4.7 R7_Filters3-4.1 R10_Filters3-4.2)
Flp2: Pedal_Filters (IC7.5 U2.14), Filters1-2 (IC31_Filters1-2.1 J13_Filters1-2.7 R23_Filters1-2.2 R26_Filters1-2.1)
Flp2: Pedal_Filters (IC14.5 U4.14), Filters3-4 (IC31_Filters3-4.1 J13_Filters3-4.7 R23_Filters3-4.2 R26_Filters3-4.1)
Q_POT_W1: Pedal_Filters (J15.2), Filters1-2 (J10_Filters1-2.4 R48_Filters1-2.1)
Q_POT_W1: Pedal_Filters (J19.2), Filters3-4 (J10_Filters3-4.4 R48_Filters3-4.1)
Q_POT_W2: Pedal_Filters (J17.2), Filters1-2 (J13_Filters1-2.4 R59_Filters1-2.1)
Q_POT_W2: Pedal_Filters (J21.2), Filters3-4 (J13_Filters3-4.4 R59_Filters3-4.1)